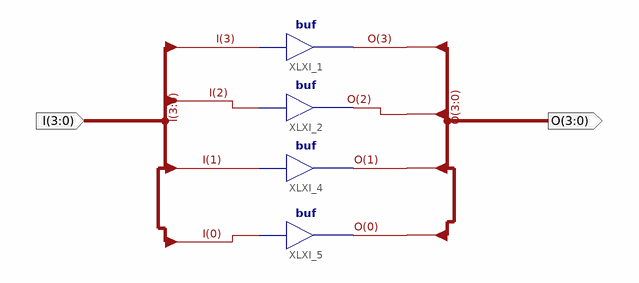
[diagram p0: schematic sheet 1]
// Xilinx ISE schematic Bit4_Connector.sch (spartan3e) as structural Verilog: 4 symbols, 2 ports
module Bit4_Connector (
  input  [3:0] I,
  output [3:0] O
);

  buf XLXI_1 (O[3], I[3]);
  buf XLXI_2 (O[2], I[2]);
  buf XLXI_4 (O[1], I[1]);
  buf XLXI_5 (O[0], I[0]);
endmodule
